# EAGLE design Network_L (EAGLE 9.3.0)
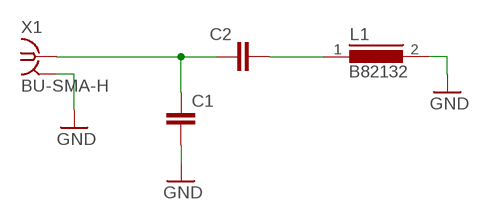
[diagram p0: schematic, sheet 1]

## Parts
C1  C-EU075-032X103  [C075-032X103]
C2  C-EU075-032X103  [C075-032X103]
L1  B82132  [SUKW2-22]
X1  BU-SMA-H  [BU-SMA-H]

## Nets
GND: C1.2 L1.2 X1.2 X1.3 X1.4 X1.5
N$1: C1.1 C2.1 X1.1
N$2: C2.2 L1.1

## Library data of the parts
C1 C2 = rcl:C-EU: CAPACITOR, European symbol; SPICEPREFIX: C
L1 = inductors:B82132: INDUCTOR; SPICEPREFIX: L
X1 = con-coax:BU-SMA-H: FEMALE SMA CONNECTOR Radiall; OC_FARNELL: unknown; OC_NEWARK: unknown

## Board
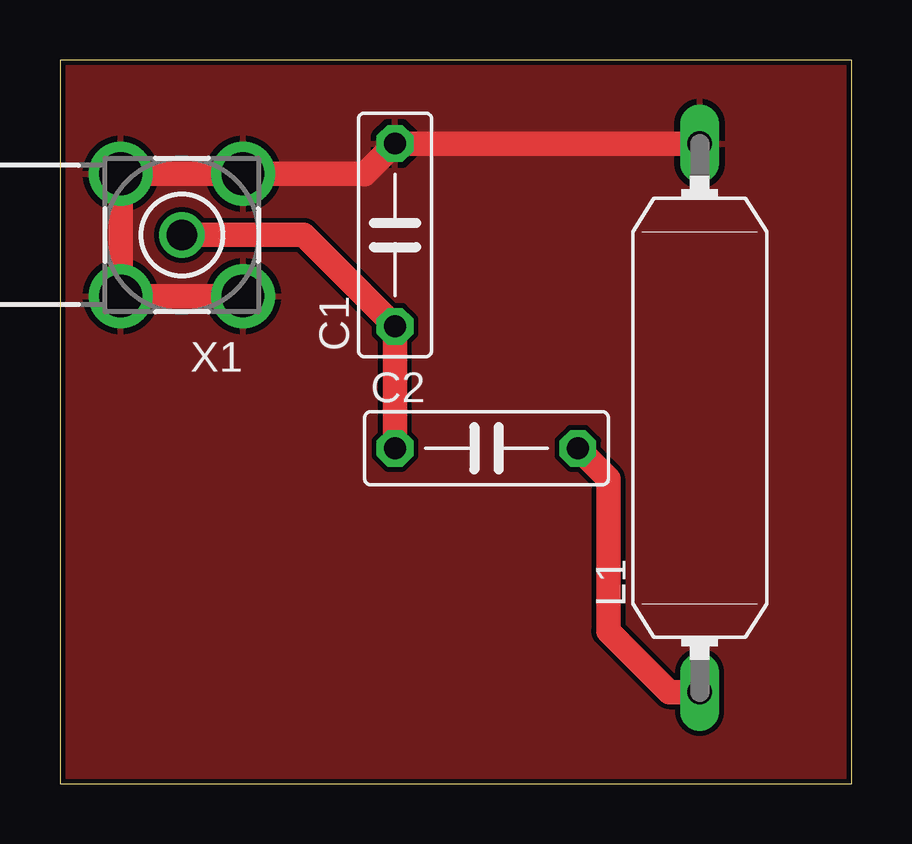
[diagram p1: board, top side]

Size 33 x 30.15 mm. Coordinates in mm from the lower left corner, seen from the top.
Outline: 0,0 33,0 33,30.15 0,30.15 0,0
Copper layers (1*16): Top 0.035mm / dielectric 1.5mm / Bottom 0.035mm
Design rules "SparkFun": minimum track width 8mil, minimum drill 20mil, track to track 8mil, track to pad 8mil, pad to pad 8mil, via to via 8mil, smd to smd 8mil, copper to edge 8mil, drill to drill 8mil, minimum pad ring 12mil, minimum via ring 10mil, stop-mask expansion 4mil, vias tented up to drill 20mil, thermal gap 10mil

### Footprints (pad centres in the part's own frame; a part is rotated, then mirrored left to right if it is on the bottom)
C075-032X103 = drill 0.914 octagon: 1 -3.81,0; 2 3.81,0
SUKW2-22 = drill 1.016 long: 1 -11.43,0; 2 11.43,0
BU-SMA-H = drill 1.27: 1 0,0 | drill 1.778: 2 -2.55,2.55; 3 2.55,2.55; 4 2.55,-2.55; 5 -2.55,-2.55

### Placement (x,y rotation side)
C1  13.97,22.86 90 top
C2  17.78,13.97 0 top
L1  26.67,15.24 90 top
X1  5.08,22.86 180 top

### Tracks (layer width: path | path; a pad name or v marks a point on that pad's centre or on a via)
GND
  Top 1.016: X1.2 X1.3 X1.4 X1.5 12.69,25.41 12.7,25.4 C1.2 L1.2
  pour Top: -1.27,31.75 34.29,31.75 34.29,-1.27 -1.27,-1.27
N$1
  Top 1.016: X1.1 10.16,22.86 C1.1 C2.1
N$2
  Top 1.016: C2.2 22.86,12.7 22.86,6.35 25.4,3.81 L1.1